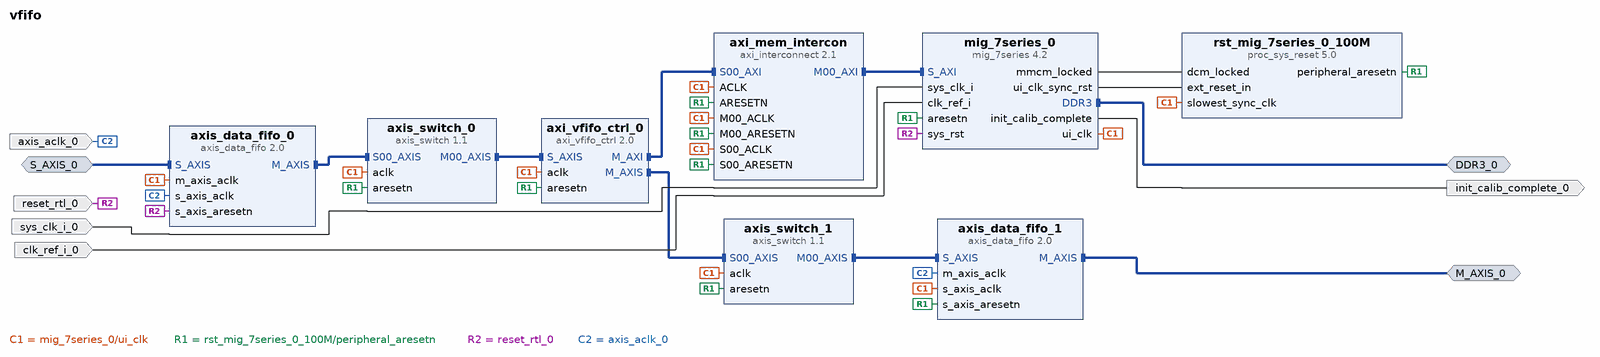
[diagram p0: block diagram of the top level]
# Vivado block design vfifo, xc7a100tfgg484-2, Vivado 2019.1
create_bd_design vfifo

create_bd_intf_port -mode Master -vlnv xilinx.com:interface:ddrx_rtl:1.0 DDR3_0
create_bd_intf_port -mode Slave -vlnv xilinx.com:interface:axis_rtl:1.0 S_AXIS_0
set_property -dict [list \
  CONFIG.HAS_TKEEP 0 \
  CONFIG.HAS_TLAST 1 \
  CONFIG.HAS_TREADY 1 \
  CONFIG.HAS_TSTRB 0 \
  CONFIG.LAYERED_METADATA undef \
  CONFIG.TDATA_NUM_BYTES 4 \
  CONFIG.TDEST_WIDTH 0 \
  CONFIG.TID_WIDTH 0 \
  CONFIG.TUSER_WIDTH 0 \
] [get_bd_intf_ports S_AXIS_0]
create_bd_intf_port -mode Master -vlnv xilinx.com:interface:axis_rtl:1.0 M_AXIS_0
create_bd_port -dir I -type rst reset_rtl_0
set_property -dict {CONFIG.POLARITY ACTIVE_LOW} [get_bd_ports reset_rtl_0]
create_bd_port -dir I -type clk sys_clk_i_0
create_bd_port -dir I -type clk clk_ref_i_0
create_bd_port -dir O init_calib_complete_0
create_bd_port -dir I -type clk axis_aclk_0

create_bd_cell -type ip -vlnv xilinx.com:ip:axi_interconnect:2.1 axi_mem_intercon
set_property -dict {CONFIG.NUM_MI 1} [get_bd_cells axi_mem_intercon]
create_bd_cell -type ip -vlnv xilinx.com:ip:axi_vfifo_ctrl:2.0 axi_vfifo_ctrl_0
set_property -dict [list \
  CONFIG.axi_burst_size 1024 \
  CONFIG.number_of_page_ch0 512 \
  CONFIG.number_of_page_ch1 16 \
] [get_bd_cells axi_vfifo_ctrl_0]
create_bd_cell -type ip -vlnv xilinx.com:ip:axis_data_fifo:2.0 axis_data_fifo_0
set_property -dict [list \
  CONFIG.FIFO_DEPTH 32 \
  CONFIG.HAS_TLAST 1 \
  CONFIG.IS_ACLK_ASYNC 1 \
  CONFIG.TDATA_NUM_BYTES 4 \
] [get_bd_cells axis_data_fifo_0]
create_bd_cell -type ip -vlnv xilinx.com:ip:axis_data_fifo:2.0 axis_data_fifo_1
set_property -dict [list \
  CONFIG.FIFO_DEPTH 32 \
  CONFIG.HAS_TKEEP 0 \
  CONFIG.HAS_TSTRB 0 \
  CONFIG.IS_ACLK_ASYNC 1 \
  CONFIG.TDEST_WIDTH 0 \
  CONFIG.TID_WIDTH 0 \
] [get_bd_cells axis_data_fifo_1]
create_bd_cell -type ip -vlnv xilinx.com:ip:axis_switch:1.1 axis_switch_0
set_property -dict {CONFIG.TDATA_NUM_BYTES 4} [get_bd_cells axis_switch_0]
create_bd_cell -type ip -vlnv xilinx.com:ip:axis_switch:1.1 axis_switch_1
set_property -dict {CONFIG.DECODER_REG 1 CONFIG.NUM_MI 2 CONFIG.NUM_SI 1} [get_bd_cells axis_switch_1]
create_bd_cell -type ip -vlnv xilinx.com:ip:mig_7series:4.2 mig_7series_0
set_property -dict [list \
  CONFIG.BOARD_MIG_PARAM Custom \
  CONFIG.MIG_DONT_TOUCH_PARAM Custom \
  CONFIG.RESET_BOARD_INTERFACE Custom \
  CONFIG.XML_INPUT_FILE mig_b.prj \
] [get_bd_cells mig_7series_0]
create_bd_cell -type ip -vlnv xilinx.com:ip:proc_sys_reset:5.0 rst_mig_7series_0_100M

# ---- connections ----

connect_bd_intf_net [get_bd_intf_pins axis_data_fifo_1/S_AXIS] [get_bd_intf_pins axis_switch_1/M00_AXIS]
connect_bd_intf_net [get_bd_intf_pins axi_vfifo_ctrl_0/M_AXIS] [get_bd_intf_pins axis_switch_1/S00_AXIS]
connect_bd_intf_net [get_bd_intf_pins axi_vfifo_ctrl_0/M_AXI] [get_bd_intf_pins axi_mem_intercon/S00_AXI]
connect_bd_intf_net [get_bd_intf_ports M_AXIS_0] [get_bd_intf_pins axis_data_fifo_1/M_AXIS]
connect_bd_intf_net [get_bd_intf_pins axi_mem_intercon/M00_AXI] [get_bd_intf_pins mig_7series_0/S_AXI]
connect_bd_intf_net [get_bd_intf_pins axis_data_fifo_0/M_AXIS] [get_bd_intf_pins axis_switch_0/S00_AXIS]
connect_bd_intf_net -intf_net S_AXIS_0_1 [get_bd_intf_ports S_AXIS_0] [get_bd_intf_pins axis_data_fifo_0/S_AXIS]
connect_bd_intf_net [get_bd_intf_ports DDR3_0] [get_bd_intf_pins mig_7series_0/DDR3]
connect_bd_intf_net [get_bd_intf_pins axi_vfifo_ctrl_0/S_AXIS] [get_bd_intf_pins axis_switch_0/M00_AXIS]
connect_bd_net [get_bd_pins mig_7series_0/ui_clk] \
  [get_bd_pins axi_mem_intercon/ACLK] [get_bd_pins axi_mem_intercon/S00_ACLK] [get_bd_pins axi_mem_intercon/M00_ACLK] \
  [get_bd_pins axi_vfifo_ctrl_0/aclk] [get_bd_pins axis_data_fifo_0/m_axis_aclk] [get_bd_pins axis_data_fifo_1/s_axis_aclk] \
  [get_bd_pins axis_switch_0/aclk] [get_bd_pins axis_switch_1/aclk] [get_bd_pins rst_mig_7series_0_100M/slowest_sync_clk]
connect_bd_net [get_bd_pins mig_7series_0/mmcm_locked] [get_bd_pins rst_mig_7series_0_100M/dcm_locked]
connect_bd_net [get_bd_pins mig_7series_0/ui_clk_sync_rst] [get_bd_pins rst_mig_7series_0_100M/ext_reset_in]
connect_bd_net [get_bd_pins rst_mig_7series_0_100M/peripheral_aresetn] \
  [get_bd_pins axi_mem_intercon/ARESETN] [get_bd_pins axi_mem_intercon/S00_ARESETN] \
  [get_bd_pins axi_mem_intercon/M00_ARESETN] [get_bd_pins axi_vfifo_ctrl_0/aresetn] \
  [get_bd_pins axis_data_fifo_1/s_axis_aresetn] [get_bd_pins axis_switch_0/aresetn] [get_bd_pins axis_switch_1/aresetn] \
  [get_bd_pins mig_7series_0/aresetn]
connect_bd_net -net reset_rtl_0_1 [get_bd_ports reset_rtl_0] [get_bd_pins axis_data_fifo_0/s_axis_aresetn] [get_bd_pins mig_7series_0/sys_rst]
connect_bd_net -net sys_clk_i_0_1 [get_bd_ports sys_clk_i_0] [get_bd_pins mig_7series_0/sys_clk_i]
connect_bd_net -net clk_ref_i_0_1 [get_bd_ports clk_ref_i_0] [get_bd_pins mig_7series_0/clk_ref_i]
connect_bd_net [get_bd_pins mig_7series_0/init_calib_complete] [get_bd_ports init_calib_complete_0]
connect_bd_net -net s_axis_aclk_0_1 [get_bd_ports axis_aclk_0] [get_bd_pins axis_data_fifo_0/s_axis_aclk] [get_bd_pins axis_data_fifo_1/m_axis_aclk]

# ---- address map ----
assign_bd_address -offset 0x80000000 -range 512M -target_address_space [get_bd_addr_spaces axi_vfifo_ctrl_0/Data_S2MM] [get_bd_addr_segs mig_7series_0/memmap/memaddr]

validate_bd_design
save_bd_design
